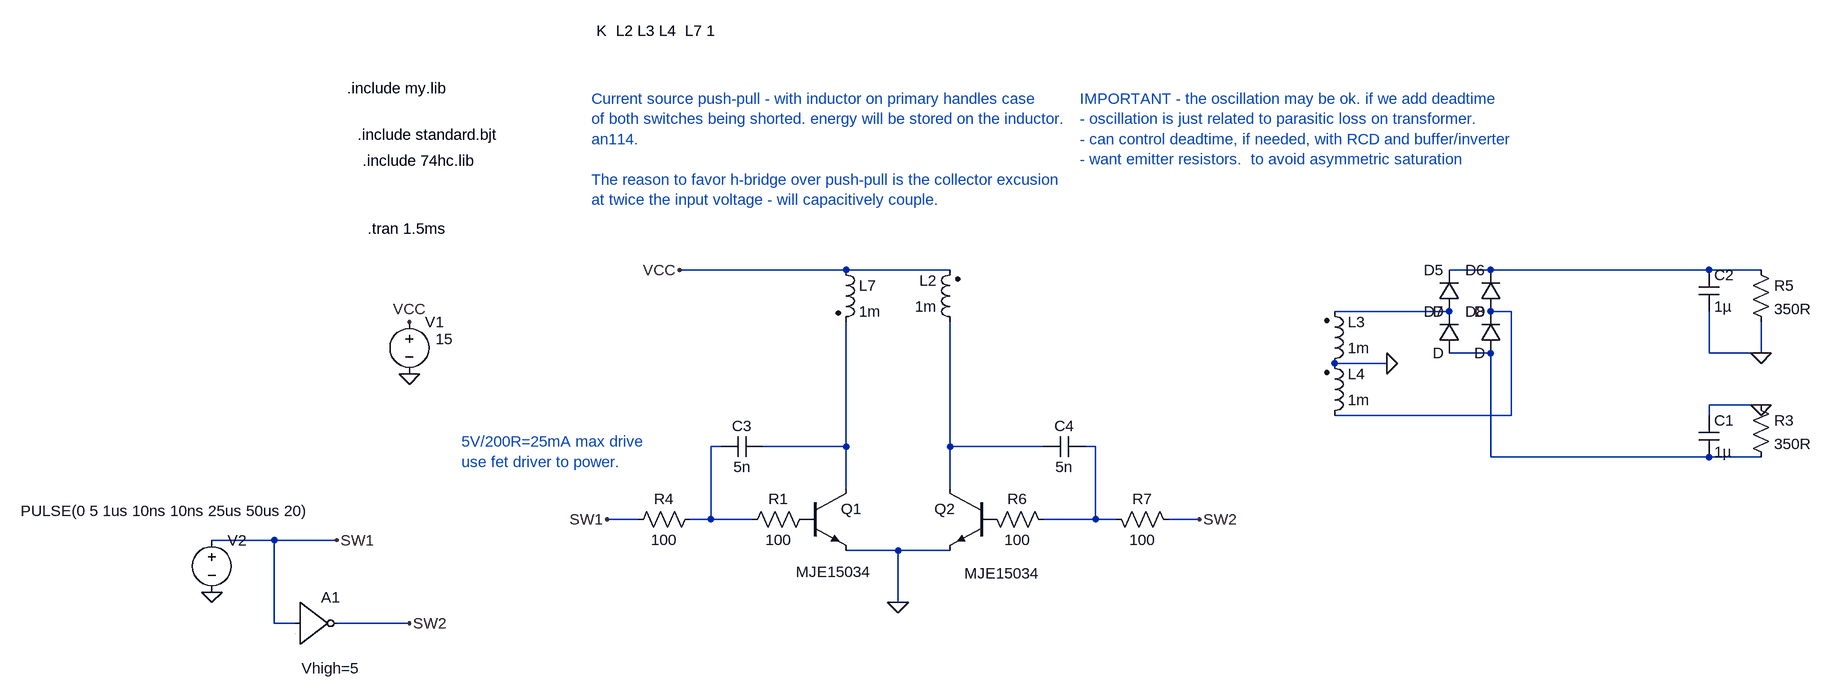
[diagram p0: schematic Draft24.asc]
Draft24.asc, the LTspice schematic file:
Version 4
SHEET 1 5720 1740
WIRE 1504 -128 1248 -128
WIRE 1664 -128 1504 -128
WIRE 2496 -128 2432 -128
WIRE 2832 -128 2496 -128
WIRE 2912 -128 2832 -128
WIRE 2432 -64 2256 -64
WIRE 2528 -64 2496 -64
WIRE 2496 0 2432 0
WIRE 2832 0 2832 -64
WIRE 2912 0 2912 -48
WIRE 2912 0 2832 0
WIRE 2336 16 2256 16
WIRE 2912 80 2832 80
WIRE 2528 96 2528 -64
WIRE 2528 96 2256 96
WIRE 2832 96 2832 80
WIRE 1312 144 1296 144
WIRE 1504 144 1504 -48
WIRE 1504 144 1376 144
WIRE 1664 144 1664 -48
WIRE 1808 144 1664 144
WIRE 1888 144 1872 144
WIRE 2496 160 2496 0
WIRE 2832 160 2496 160
WIRE 2912 160 2832 160
WIRE 1504 208 1504 144
WIRE 1664 208 1664 144
WIRE 1184 256 1136 256
WIRE 1296 256 1296 144
WIRE 1296 256 1264 256
WIRE 1360 256 1296 256
WIRE 1888 256 1888 144
WIRE 1888 256 1808 256
WIRE 1920 256 1888 256
WIRE 2048 256 2000 256
WIRE 624 288 528 288
WIRE 720 288 624 288
WIRE 1584 304 1504 304
WIRE 1664 304 1584 304
WIRE 1584 384 1584 304
WIRE 624 416 624 288
WIRE 656 416 624 416
WIRE 832 416 720 416
FLAG 2912 0 0
FLAG 2336 16 0
FLAG 2912 80 0
FLAG 832 32 0
FLAG 832 -48 VCC
FLAG 1248 -128 VCC
FLAG 1584 384 0
FLAG 2048 256 SW2
FLAG 528 368 0
FLAG 720 288 SW1
FLAG 832 416 SW2
FLAG 1136 256 SW1
SYMBOL ind2 2240 32 M180
WINDOW 0 36 80 Left 2
WINDOW 3 36 40 Left 2
SYMATTR InstName L3
SYMATTR Value 1m
SYMATTR Type ind
SYMBOL ind2 1680 -32 R180
WINDOW 0 36 80 Left 2
WINDOW 3 36 40 Left 2
SYMATTR InstName L2
SYMATTR Value 1m
SYMATTR Type ind
SYMBOL diode 2448 -64 R180
WINDOW 0 24 64 Left 2
WINDOW 3 24 0 Left 2
SYMATTR InstName D5
SYMBOL diode 2512 -64 R180
WINDOW 0 24 64 Left 2
WINDOW 3 24 0 Left 2
SYMATTR InstName D6
SYMBOL diode 2448 0 R180
WINDOW 0 24 64 Left 2
WINDOW 3 24 0 Left 2
SYMATTR InstName D7
SYMBOL diode 2512 0 R180
WINDOW 0 24 64 Left 2
WINDOW 3 24 0 Left 2
SYMATTR InstName D8
SYMBOL cap 2816 -128 R0
SYMATTR InstName C2
SYMATTR Value 1µ
SYMBOL res 2896 -144 R0
SYMATTR InstName R5
SYMATTR Value 350R
SYMBOL ind2 2240 112 M180
WINDOW 0 36 80 Left 2
WINDOW 3 36 40 Left 2
SYMATTR InstName L4
SYMATTR Value 1m
SYMATTR Type ind
SYMBOL cap 2816 96 R0
SYMATTR InstName C1
SYMATTR Value 1µ
SYMBOL res 2896 64 R0
SYMATTR InstName R3
SYMATTR Value 350R
SYMBOL voltage 832 -64 R0
WINDOW 123 0 0 Left 0
WINDOW 39 0 0 Left 0
WINDOW 3 40 42 Left 2
SYMATTR Value 15
SYMATTR InstName V1
SYMBOL ind2 1488 -144 R0
SYMATTR InstName L7
SYMATTR Value 1m
SYMATTR Type ind
SYMBOL res 1456 240 R90
WINDOW 0 0 56 VBottom 2
WINDOW 3 32 56 VTop 2
SYMATTR InstName R1
SYMATTR Value 100
SYMBOL npn 1440 208 R0
WINDOW 3 -13 129 Left 2
SYMATTR Value MJE15034
SYMATTR InstName Q1
SYMBOL npn 1728 208 M0
WINDOW 3 -74 131 Left 2
SYMATTR Value MJE15034
SYMATTR InstName Q2
SYMBOL voltage 528 272 R0
WINDOW 123 0 0 Left 0
WINDOW 39 0 0 Left 0
WINDOW 3 -294 -29 Left 2
SYMATTR Value PULSE(0 5 1us 10ns 10ns 25us 50us 20)
SYMATTR InstName V2
SYMBOL Digital\\inv 656 352 R0
WINDOW 3 10 133 Left 2
SYMATTR Value Vhigh=5
SYMATTR InstName A1
SYMBOL cap 1376 128 R90
WINDOW 0 0 32 VBottom 2
WINDOW 3 32 32 VTop 2
SYMATTR InstName C3
SYMATTR Value 5n
SYMBOL res 1280 240 R90
WINDOW 0 0 56 VBottom 2
WINDOW 3 32 56 VTop 2
SYMATTR InstName R4
SYMATTR Value 100
SYMBOL res 1712 240 M90
WINDOW 0 0 56 VBottom 2
WINDOW 3 32 56 VTop 2
SYMATTR InstName R6
SYMATTR Value 100
SYMBOL cap 1808 128 M90
WINDOW 0 0 32 VBottom 2
WINDOW 3 32 32 VTop 2
SYMATTR InstName C4
SYMATTR Value 5n
SYMBOL res 1904 240 M90
WINDOW 0 0 56 VBottom 2
WINDOW 3 32 56 VTop 2
SYMATTR InstName R7
SYMATTR Value 100
TEXT 768 -192 Left 2 !.tran 1.5ms
TEXT 1120 -496 Left 2 !K  L2 L3 L4  L7 1
TEXT 752 -336 Left 2 !.include standard.bjt
TEXT 736 -408 Left 2 !.include my.lib
TEXT 760 -296 Left 2 !.include 74hc.lib
TEXT 912 136 Left 2 ;5V/200R=25mA max drive\nuse fet driver to power.
TEXT 1864 -392 Left 2 ;IMPORTANT - the oscillation may be ok. if we add deadtime\n- oscillation is just related to parasitic loss on transformer.\n- can control deadtime, if needed, with RCD and buffer/inverter\n- want emitter resistors.  to avoid asymmetric saturation
TEXT 1112 -392 Left 2 ;Current source push-pull - with inductor on primary handles case\nof both switches being shorted. energy will be stored on the inductor.\nan114.\n \nThe reason to favor h-bridge over push-pull is the collector excusion\nat twice the input voltage - will capacitively couple.

The netlist it stands for:
* Draft24.asc
L3 0 N002 1m
L2 N007 VCC 1m
D5 N002 N001 D
D6 N003 N001 D
D7 N004 N002 D
D8 N004 N003 D
C2 N001 0 1µ
R5 N001 0 350R
L4 N003 0 1m
C1 0 N004 1µ
R3 0 N004 350R
V1 VCC 0 15
L7 VCC N006 1m
R1 P001 N005 100
Q1 N006 P001 0 0 MJE15034
Q2 N007 P002 0 0 MJE15034
V2 SW1 0 PULSE(0 5 1us 10ns 10ns 25us 50us 20)
A1 SW1 0 0 0 0 SW2 0 0 BUF Vhigh=5
C3 N006 N005 5n
R4 N005 SW1 100
R6 P002 N008 100
C4 N007 N008 5n
R7 N008 SW2 100
.model D D
.lib standard.dio
.model NPN NPN
.model PNP PNP
.lib standard.bjt
.tran 1.5ms
K  L2 L3 L4  L7 1
.include standard.bjt
.include my.lib
.include 74hc.lib
* 5V/200R=25mA max drive
* use fet driver to power.
* IMPORTANT - the oscillation may be ok. if we add deadtime
* - oscillation is just related to parasitic loss on transformer.
* - can control deadtime, if needed, with RCD and buffer/inverter
* - want emitter resistors.  to avoid asymmetric saturation
* Current source push-pull - with inductor on primary handles case
* of both switches being shorted. energy will be stored on the inductor.
* an114.
* The reason to favor h-bridge over push-pull is the collector excusion
* at twice the input voltage - will capacitively couple.
.backanno
.end